# Altium schematic sheet ARDUINO_IO.SchDoc
size B; Organization: Altium Limited; Address1: 3 Minna Close; Address2: Belrose; Address3: NSW 2085; Address4: Australia; SheetNumber: 7; SheetTotal: 7
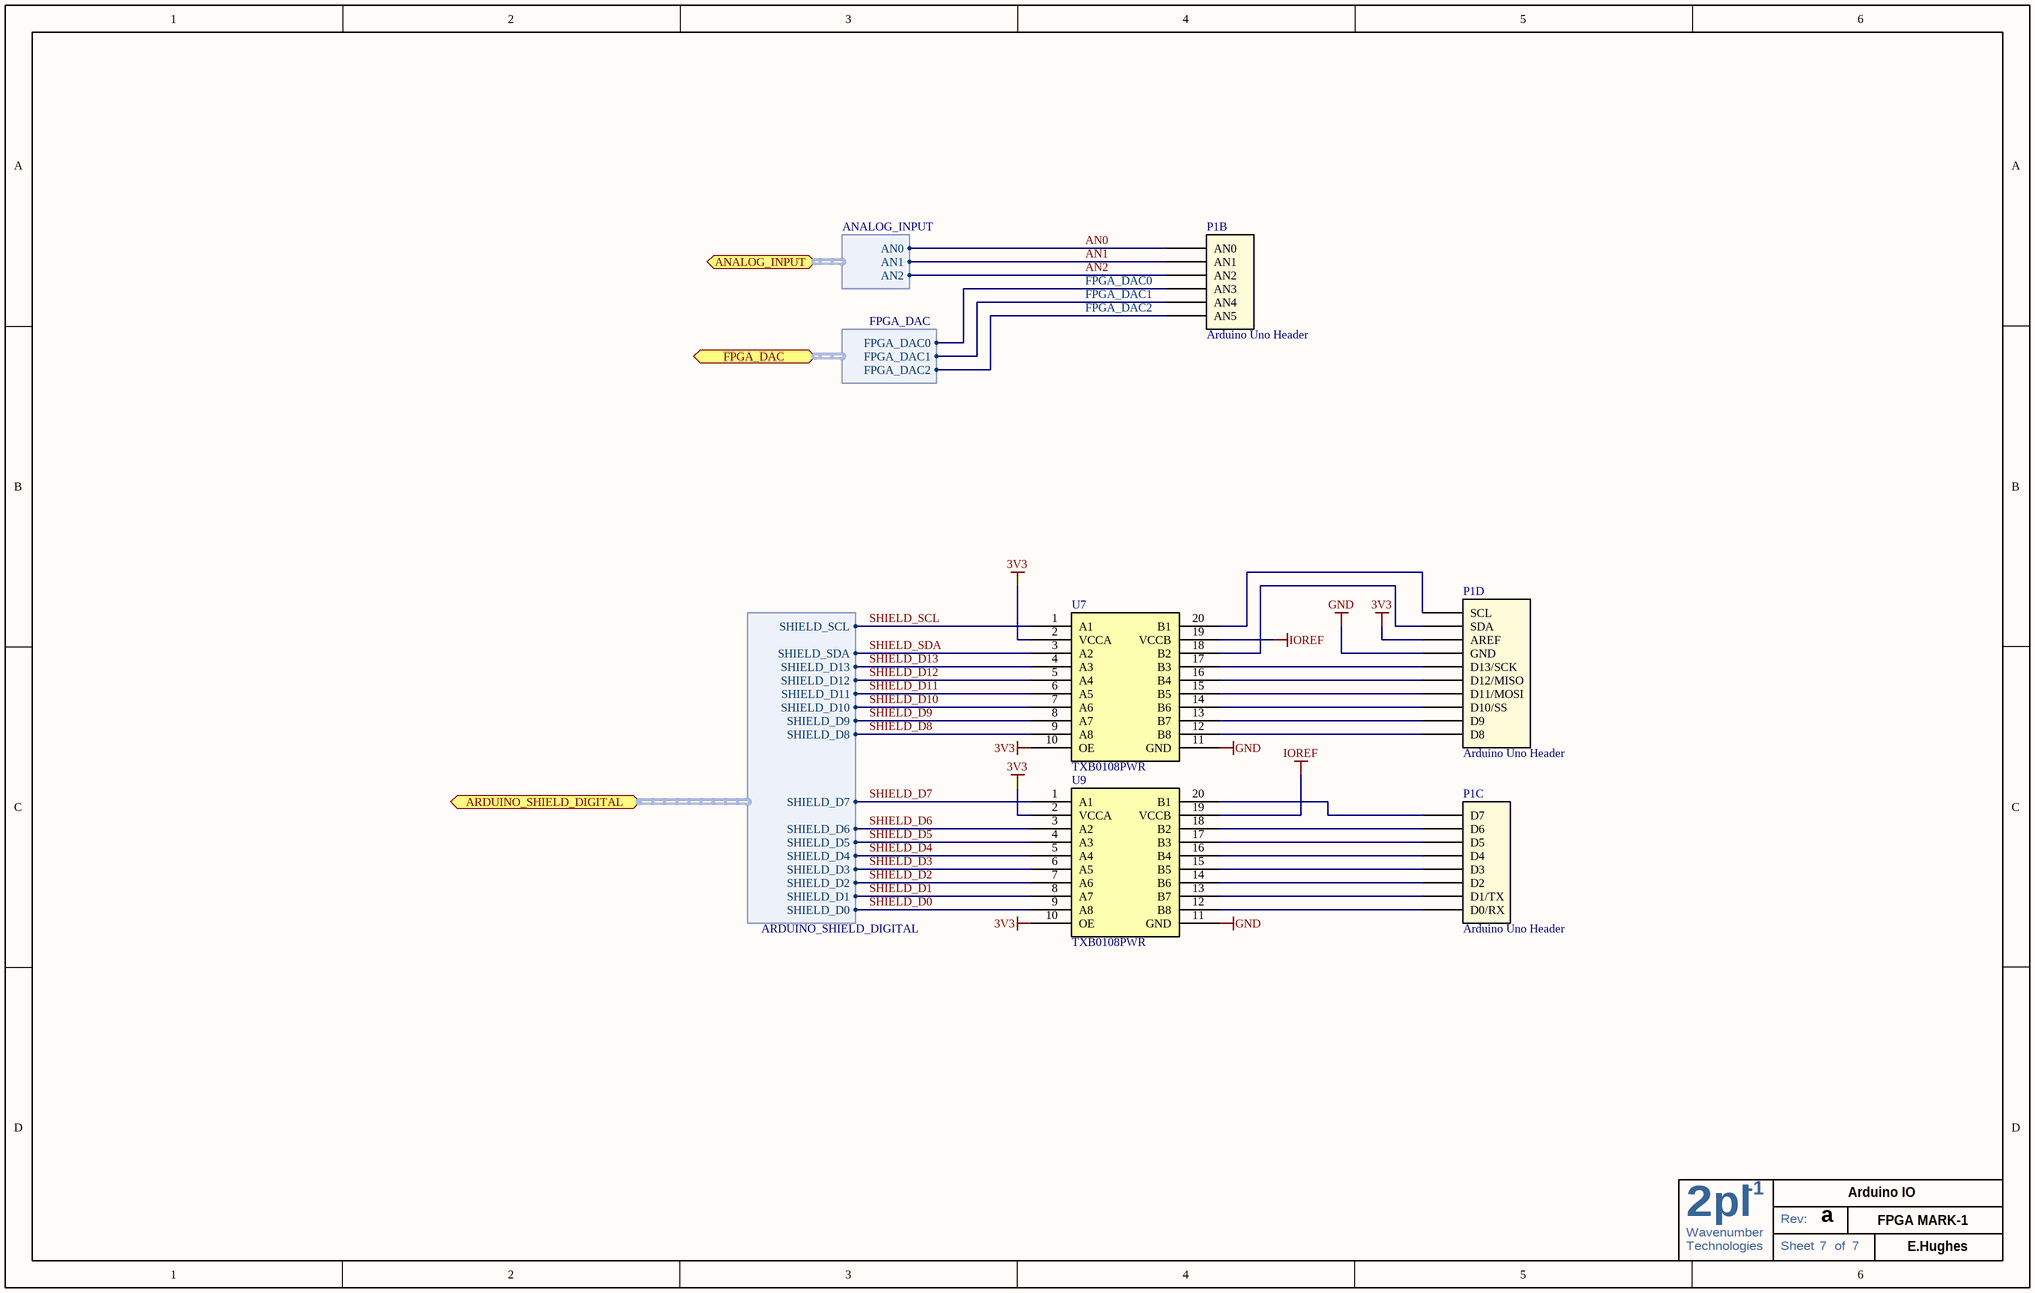
[diagram p0: ARDUINO_IO.SchDoc]

## Parts
P1  Arduino Uno Header  [Arduino Shield - smaller Thru]  (parts B,C,D of 4)
U7  TXB0108PWR  [TSSOP20]
U9  TXB0108PWR  [TSSOP20]

## Ports
ANALOG_INPUT (harness ANALOG_INPUT), ARDUINO_SHIELD_DIGITAL (harness ARDUINO_SHIELD_DIGITAL), FPGA_DAC (harness FPGA_DAC)

## Harnesses
ANALOG_INPUT: AN0, AN1, AN2
FPGA_DAC: FPGA_DAC0, FPGA_DAC1, FPGA_DAC2
ARDUINO_SHIELD_DIGITAL: SHIELD_D13, SHIELD_D12, SHIELD_D11, SHIELD_D10, SHIELD_D9, SHIELD_D8, SHIELD_D7, SHIELD_D6, SHIELD_D5, SHIELD_D4, SHIELD_D3, SHIELD_D2, SHIELD_D1, SHIELD_D0, SHIELD_SDA, SHIELD_SCL

## Nets
3V3: P1.D8(AREF) U7.2(VCCA) U7.10(OE) U9.2(VCCA) U9.10(OE)
GND: P1.D7(GND) U7.11(GND) U9.11(GND)
IOREF: U7.19(VCCB) U9.19(VCCB)
AN0: P1.B1(AN0) ; port ANALOG_INPUT.AN0
AN1: P1.B2(AN1) ; port ANALOG_INPUT.AN1
AN2: P1.B3(AN2) ; port ANALOG_INPUT.AN2
FPGA_DAC0: P1.B4(AN3) ; port FPGA_DAC.FPGA_DAC0
FPGA_DAC1: P1.B5(AN4) ; port FPGA_DAC.FPGA_DAC1
FPGA_DAC2: P1.B6(AN5) ; port FPGA_DAC.FPGA_DAC2
SHIELD_D0: U9.9(A8) ; port ARDUINO_SHIELD_DIGITAL.SHIELD_D0
SHIELD_D1: U9.8(A7) ; port ARDUINO_SHIELD_DIGITAL.SHIELD_D1
SHIELD_D2: U9.7(A6) ; port ARDUINO_SHIELD_DIGITAL.SHIELD_D2
SHIELD_D3: U9.6(A5) ; port ARDUINO_SHIELD_DIGITAL.SHIELD_D3
SHIELD_D4: U9.5(A4) ; port ARDUINO_SHIELD_DIGITAL.SHIELD_D4
SHIELD_D5: U9.4(A3) ; port ARDUINO_SHIELD_DIGITAL.SHIELD_D5
SHIELD_D6: U9.3(A2) ; port ARDUINO_SHIELD_DIGITAL.SHIELD_D6
SHIELD_D7: U9.1(A1) ; port ARDUINO_SHIELD_DIGITAL.SHIELD_D7
SHIELD_D8: U7.9(A8) ; port ARDUINO_SHIELD_DIGITAL.SHIELD_D8
SHIELD_D9: U7.8(A7) ; port ARDUINO_SHIELD_DIGITAL.SHIELD_D9
SHIELD_D10: U7.7(A6) ; port ARDUINO_SHIELD_DIGITAL.SHIELD_D10
SHIELD_D11: U7.6(A5) ; port ARDUINO_SHIELD_DIGITAL.SHIELD_D11
SHIELD_D12: U7.5(A4) ; port ARDUINO_SHIELD_DIGITAL.SHIELD_D12
SHIELD_D13: U7.4(A3) ; port ARDUINO_SHIELD_DIGITAL.SHIELD_D13
SHIELD_SCL: U7.1(A1) ; port ARDUINO_SHIELD_DIGITAL.SHIELD_SCL
SHIELD_SDA: U7.3(A2) ; port ARDUINO_SHIELD_DIGITAL.SHIELD_SDA
NetP1_C1: P1.C1(D0/RX) U9.12(B8)
NetP1_C2: P1.C2(D1/TX) U9.13(B7)
NetP1_C3: P1.C3(D2) U9.14(B6)
NetP1_C4: P1.C4(D3) U9.15(B5)
NetP1_C5: P1.C5(D4) U9.16(B4)
NetP1_C6: P1.C6(D5) U9.17(B3)
NetP1_C7: P1.C7(D6) U9.18(B2)
NetP1_C8: P1.C8(D7) U9.20(B1)
NetP1_D1: P1.D1(D8) U7.12(B8)
NetP1_D2: P1.D2(D9) U7.13(B7)
NetP1_D3: P1.D3(D10/SS) U7.14(B6)
NetP1_D4: P1.D4(D11/MOSI) U7.15(B5)
NetP1_D5: P1.D5(D12/MISO) U7.16(B4)
NetP1_D6: P1.D6(D13/SCK) U7.17(B3)
NetP1_D9: P1.D9(SDA) U7.18(B2)
NetP1_D10: P1.D10(SCL) U7.20(B1)

## Notes on the sheet
- a
- Arduino IO
- FPGA MARK-1
- E.Hughes
- 2
- Wavenumber
- pl
- -1
- Rev:
- Technologies
- Sheet
- of

## Library data of the parts
P1 = Arduino Shield: Arduino Duem Header
U7 U9 = TXB0108PWR: IC 8-BIT TRNSTR 15KV ESD 20TSSOP; Manufacturer: Texas Instruments; Logic Function: Translator, Bidirectional; Number of Bits: 8; Input Type: Logic; Data Rate: 100Mbps; Number of Outputs/Channel: 1; Differential - Input:Output: No/No; Propagation Delay (Max): 4ns; Voltage - Supply: 1.2 V ~ 3.6 V, 1.65 V ~ 5.5 V; Supplier 1: Digi-Key; Supplier Part Number 1: 296-21527-1-ND; Manufacturer Part Number: TXB0108PWR; RoHS: RoHS Compliant; Category: Integrated Circuits (ICs); Stock 1: 12532; Pricing 1: 1=2.8, 25=2.16, 100=1.96, 250=1.76, 500=1.52, 1000=1.28 (USD); Output Type: Logic; Number of Channels: 8; Operating Temperature: -40°C ~ 85°C; Package / Case: 20-TSSOP (0.173", 4.40mm Width); Supplier Device Package: 20-TSSOP; Packaging: Cut Tape (CT); ComponentLink1URL: http://www.ti.com/lit/ds/symlink/txb0108.pdf; ComponentLink1Description: http://www.ti.com/lit/ds/symlink/txb0108.pdf; Value: TXB0108PWR